# EAGLE design 50hz_sensor (EAGLE 7.3.0)
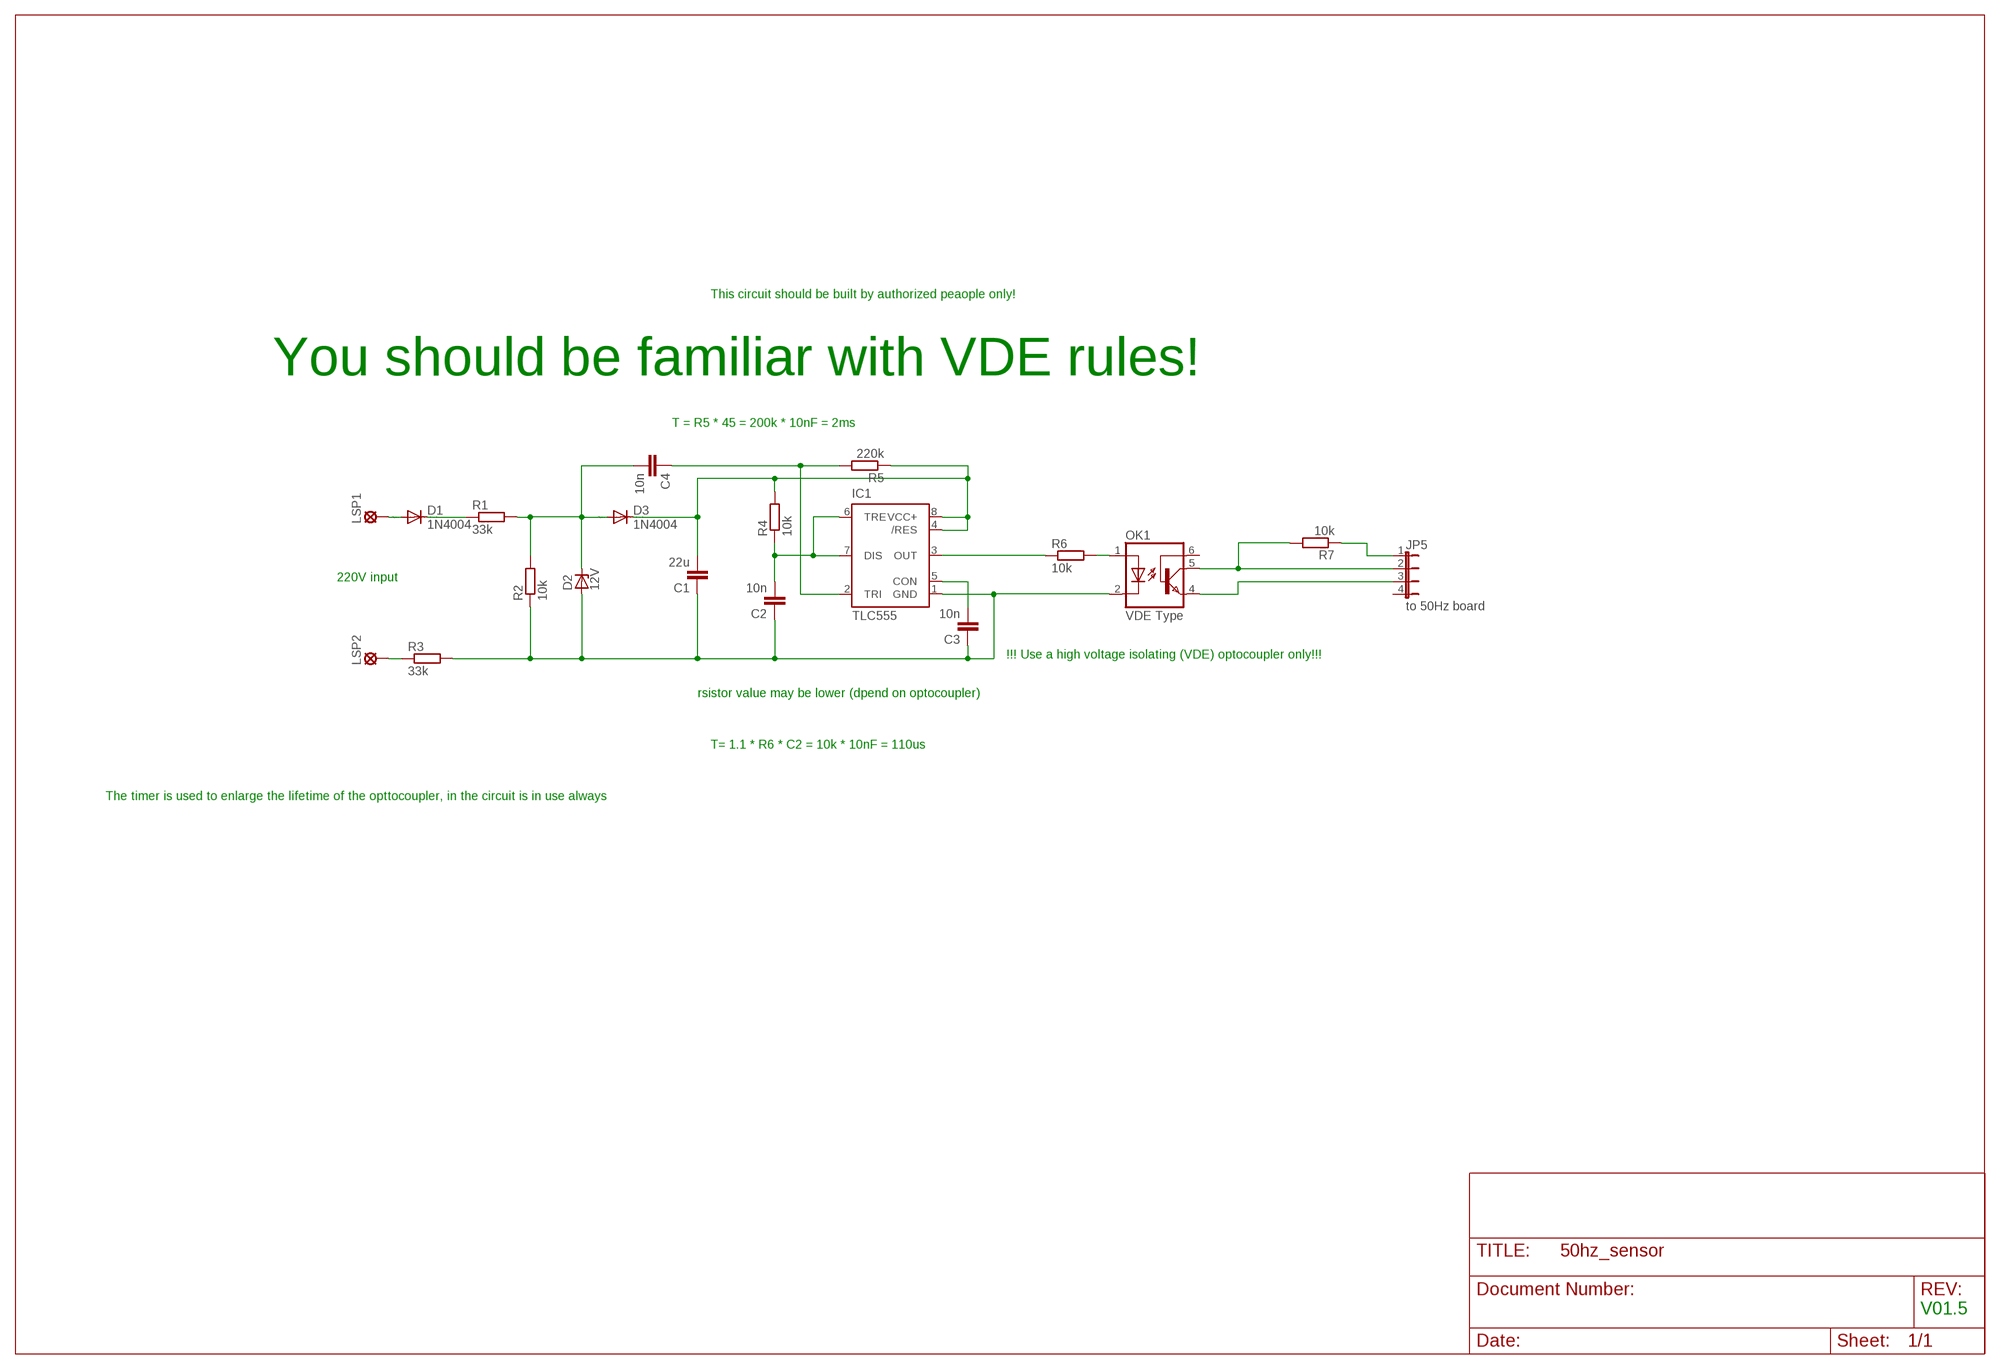
[diagram p0: schematic, sheet 1]

## Parts
C1  22u  C-EU025-040X050  [C025-040X050]
C2  10n  C-EU050-025X075  [C050-025X075]
C3  10n  C-EU050-035X075  [C050-035X075]
C4  10n  C-EU050-030X075  [C050-030X075]
D1  1N4004  [DO41-10]
D2  12V  ZENER-DIODEDO34-7  [DO34Z7]
D3  1N4004  [DO41-10]
IC1  TLC555  NE555  [DIL-08]
JP5  to 50Hz board  JP4E  [JP4]
LSP1  LSP11  [LSP11]
LSP2  LSP11  [LSP11]
OK1  VDE Type  4N28TM  [DIL6-04]
R1  33k  R-EU_0309/10  [0309/10]
R2  10k  R-EU_0309/10  [0309/10]
R3  33k  R-EU_0309/10  [0309/10]
R4  10k  R-EU_0309/10  [0309/10]
R5  220k  R-EU_0309/10  [0309/10]
R6  10k  R-EU_0309/10  [0309/10]
R7  10k  R-EU_0309/10  [0309/10]

## Nets
N$1: D1.A LSP1.MP
N$2: LSP2.MP R3.1
N$3: JP5.2 OK1.5(COL) R7.2
N$4: OK1.1(A) R6.2
N$5: C1.1 C2.1 C3.1 D2.A IC1.1(GND) OK1.2(C) R2.1 R3.2
N$6: D1.C R1.1
N$8: C4.1 IC1.2(TRI) R5.2
N$10: JP5.3 OK1.4(EMI)
N$11: JP5.1 R7.1
N$13: C1.2 D3.C IC1.4(/RES) IC1.8(VCC+) R4.2 R5.1
N$14: IC1.3(OUT) R6.1
N$15: C2.2 IC1.6(TRE) IC1.7(DIS) R4.1
N$17: C3.2 IC1.5(CON)
N$18: C4.2 D2.C D3.A R1.2 R2.2
Unconnected: JP5.4 OK1.6(BAS)

## Notes on the sheet
- This circuit should be built by authorized peaople only!
- You should be familiar with VDE rules!
- T = R5 * 45 = 200k * 10nF = 2ms
- 220V input
- !!! Use a high voltage isolating (VDE) optocoupler only!!!
- rsistor value may be lower (dpend on optocoupler)
- T= 1.1 * R6 * C2 = 10k * 10nF = 110us
- The timer is used to enlarge the lifetime of the opttocoupler, in the circuit is in use always
- V01.5

## Library data of the parts
C1-C4 = rcl:C-EU: CAPACITOR, European symbol
D1 D3 = diode:1N4004: DIODE general purpose rectifier, 1 A
D2 = diode:ZENER-DIODE: Z-Diode
IC1 = st-microelectronics:NE555: General purpose bipolar Timer; MF: Arrow Electronics; MPN: NE555N; OC_FARNELL: 1467742; OC_NEWARK: 89K1486
JP5 = jumper:JP4E: JUMPER
LSP1 LSP2 = solpad:LSP11: SOLDER PAD drill 1.1 mm
OK1 = optocoupler:4N*?M: General Purpose 6-Pin Phototransistor Optocouplers Source: http://www.fairchildsemi.com/ds/4N/4N35-M.pdf; MF: FAIRCHILD SEMICONDUCTOR; MPN: 4N28TM; OC_FARNELL: unknown; OC_NEWARK: 08H0848
R1-R7 = resistor:R-EU_: RESISTOR, European symbol

## Board
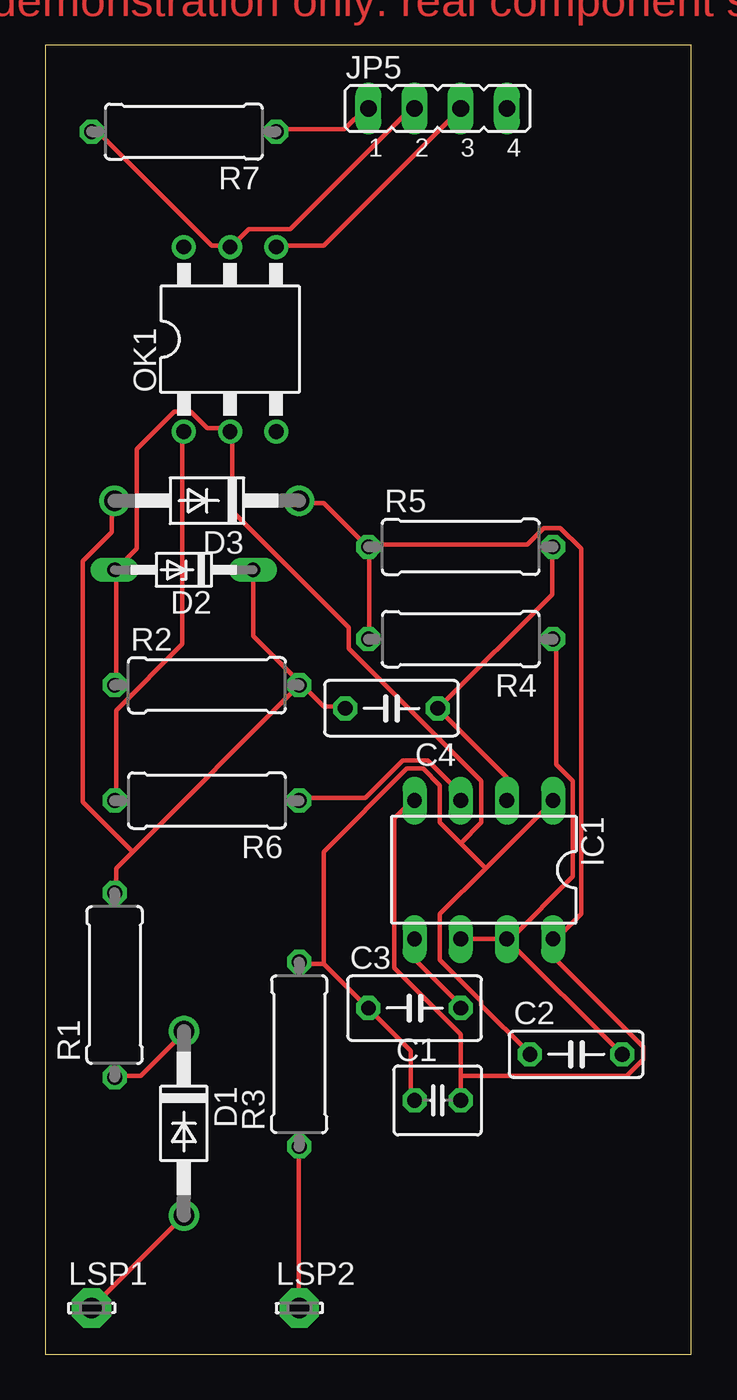
[diagram p1: board, top side]

Size 35.54 x 72.06 mm. Coordinates in mm from the lower left corner, seen from the top.
Outline: 0,0 35.54,0 35.54,72.06 0,72.06 0,0
Copper layers (1*16): Top 0.035mm / dielectric 1.5mm / Bottom 0.035mm
Design rules "default": minimum track width 10mil, minimum drill 24mil, track to track 8mil, track to pad 8mil, pad to pad 8mil, via to via 8mil, smd to smd 8mil, copper to edge 40mil, drill to drill 8mil, minimum pad ring 10mil, minimum via ring 8mil, stop-mask expansion 4mil, vias tented up to drill 0mil, thermal gap 10mil

### Footprints (pad centres in the part's own frame; a part is rotated, then mirrored left to right if it is on the bottom)
C025-040X050 = drill 0.813 octagon: 1 -1.27,0; 2 1.27,0
C050-025X075 = drill 0.813 octagon: 1 -2.54,0; 2 2.54,0
C050-035X075 = drill 0.813 octagon: 1 -2.54,0; 2 2.54,0
C050-030X075 = drill 0.813 octagon: 1 -2.54,0; 2 2.54,0
DO41-10 = drill 1.118: A 5.08,0; C -5.08,0
DO34Z7 = drill 0.813 long: A 3.81,0; C -3.81,0
DIL-08 = drill 0.813 long: 1 -3.81,-3.81; 2 -1.27,-3.81; 3 1.27,-3.81; 4 3.81,-3.81; 5 3.81,3.81; 6 1.27,3.81; 7 -1.27,3.81; 8 -3.81,3.81
JP4 = drill 0.914 long: 1 -3.81,0; 2 -1.27,0; 3 1.27,0; 4 3.81,0
LSP11 = drill 1.118 pad 2.159 octagon: MP 0,0
DIL6-04 = drill 0.813: 1 -2.54,-5.08; 2 0,-5.08; 3 2.54,-5.08; 4 2.54,5.08; 5 0,5.08; 6 -2.54,5.08
0309/10 = drill 0.813 octagon: 1 -5.08,0; 2 5.08,0

### Placement (x,y rotation side)
C1  21.59,13.97 0 top
C2  29.21,16.51 0 top
C3  20.32,19.05 0 top
C4  19.05,35.56 180 top
D1  7.62,12.7 270 top
D2  7.62,43.18 180 top
D3  8.89,46.99 180 top
IC1  24.13,26.67 180 top
JP5  21.59,68.58 0 top
LSP1  2.54,2.54 0 top
LSP2  13.97,2.54 0 top
OK1  10.16,55.88 0 top
R1  3.81,20.32 90 top
R2  8.89,36.83 0 top
R3  13.97,16.51 90 top
R4  22.86,39.37 180 top
R5  22.86,44.45 0 top
R6  8.89,30.48 180 top
R7  7.62,67.31 180 top

### Tracks (layer width: path | path; a pad name or v marks a point on that pad's centre or on a via)
N$1
  Top 0.254: LSP1.MP D1.A
N$2
  Top 0.254: R3.1 13.95,11.43 13.95,2.74 LSP2.MP
N$3
  Top 0.254: R7.2 2.74,67.44 9.14,61.04 10.06,61.04 OK1.5 10.29,61.04 11.2,61.95 13.49,61.95 20.12,68.58 JP5.2
N$4
  Top 0.254: R6.2 3.89,30.63 3.89,35.43 7.54,39.09 7.54,50.75 OK1.1
N$5
  Top 0.254: R2.1 3.89,37.03 3.89,42.98 D2.A 3.89,43.2 5.03,44.35 5.03,49.84 7.09,51.89 8,51.89 8.91,50.98 10.06,50.98 OK1.2 10.29,50.75 10.29,46.41 16.69,40.01 16.69,38.86 24,31.55 24,29.26 22.86,28.12 | C1.1 20.12,14.17 20.12,16.69 17.83,18.97 C3.1 17.6,19.2 15.32,21.49 | 15.32,21.49 14.17,21.49 R3.2 | 24.23,26.75 27.89,30.4 IC1.1 | 24.23,26.75 21.72,24.23 21.72,21.72 24,19.43 24,19.2 26.52,16.69 C2.1 | 15.32,21.49 15.32,27.66 19.89,32.23 20.8,32.23 21.72,31.32 21.72,29.26 22.86,28.12 | 24.23,26.75 22.86,28.12
N$6
  Top 0.254: R1.1 3.89,15.32 5.26,15.32 7.54,17.6 D1.C
N$8
  Top 0.254: IC1.2 25.38,30.63 25.38,31.77 C4.1 21.72,35.66 27.89,41.83 27.89,44.35 R5.2
N$10
  Top 0.254: JP5.3 15.32,61.04 12.8,61.04 OK1.4
N$11
  Top 0.254: R7.1 12.8,67.44 16.46,67.44 17.6,68.58 JP5.1
N$13
  Top 0.254: R4.2 17.83,39.55 17.83,44.35 R5.1 | D3.C 14.17,46.86 15.32,46.86 17.6,44.58 R5.1 | 22.86,15.32 22.86,17.6 19.2,21.26 19.2,29.49 20.12,30.4 IC1.4 | 22.86,15.32 C1.2 | 28.12,22.86 28.12,21.72 32.92,16.92 32.92,16.23 32,15.32 22.86,15.32 | 28.12,22.86 29.49,24.23 29.49,44.35 28.35,45.49 27.43,45.49 26.52,44.58 17.83,44.58 R5.1 | 28.12,22.86 IC1.8
N$14
  Top 0.254: IC1.3 22.86,30.86 21.03,32.69 19.66,32.69 17.6,30.63 14.17,30.63 R6.1
N$15
  Top 0.254: 25.38,22.86 IC1.6 | 25.38,22.86 31.55,16.69 C2.2 | 25.38,22.86 IC1.7 25.6,22.86 29.03,26.29 29.03,31.55 28.12,32.46 28.12,39.32 R4.1
N$17
  Top 0.254: IC1.5 20.34,22.86 20.34,21.72 22.86,19.2 C3.2
N$18
  Top 0.254: R2.2 4.8,27.66 | 4.8,27.66 3.89,26.75 3.89,25.6 R1.2 | C4.2 16.46,35.66 15.32,35.66 14.17,36.8 R2.2 | D2.C 11.43,39.55 13.95,37.03 R2.2 | 4.8,27.66 2.06,30.4 2.06,43.66 3.66,45.26 3.66,46.86 D3.A

### Text on the board
Top: This board is for demonstration only. real component shape is different